# Altium schematic sheet reTerm-HW-M-IOLINK-SUPPLY.SchDoc: reTerm IOLINK SUPPLY
size 381 x 241 mm; DocumentNumber: 4; Revision: 1.0.0; SheetNumber: 4; SheetTotal: 4
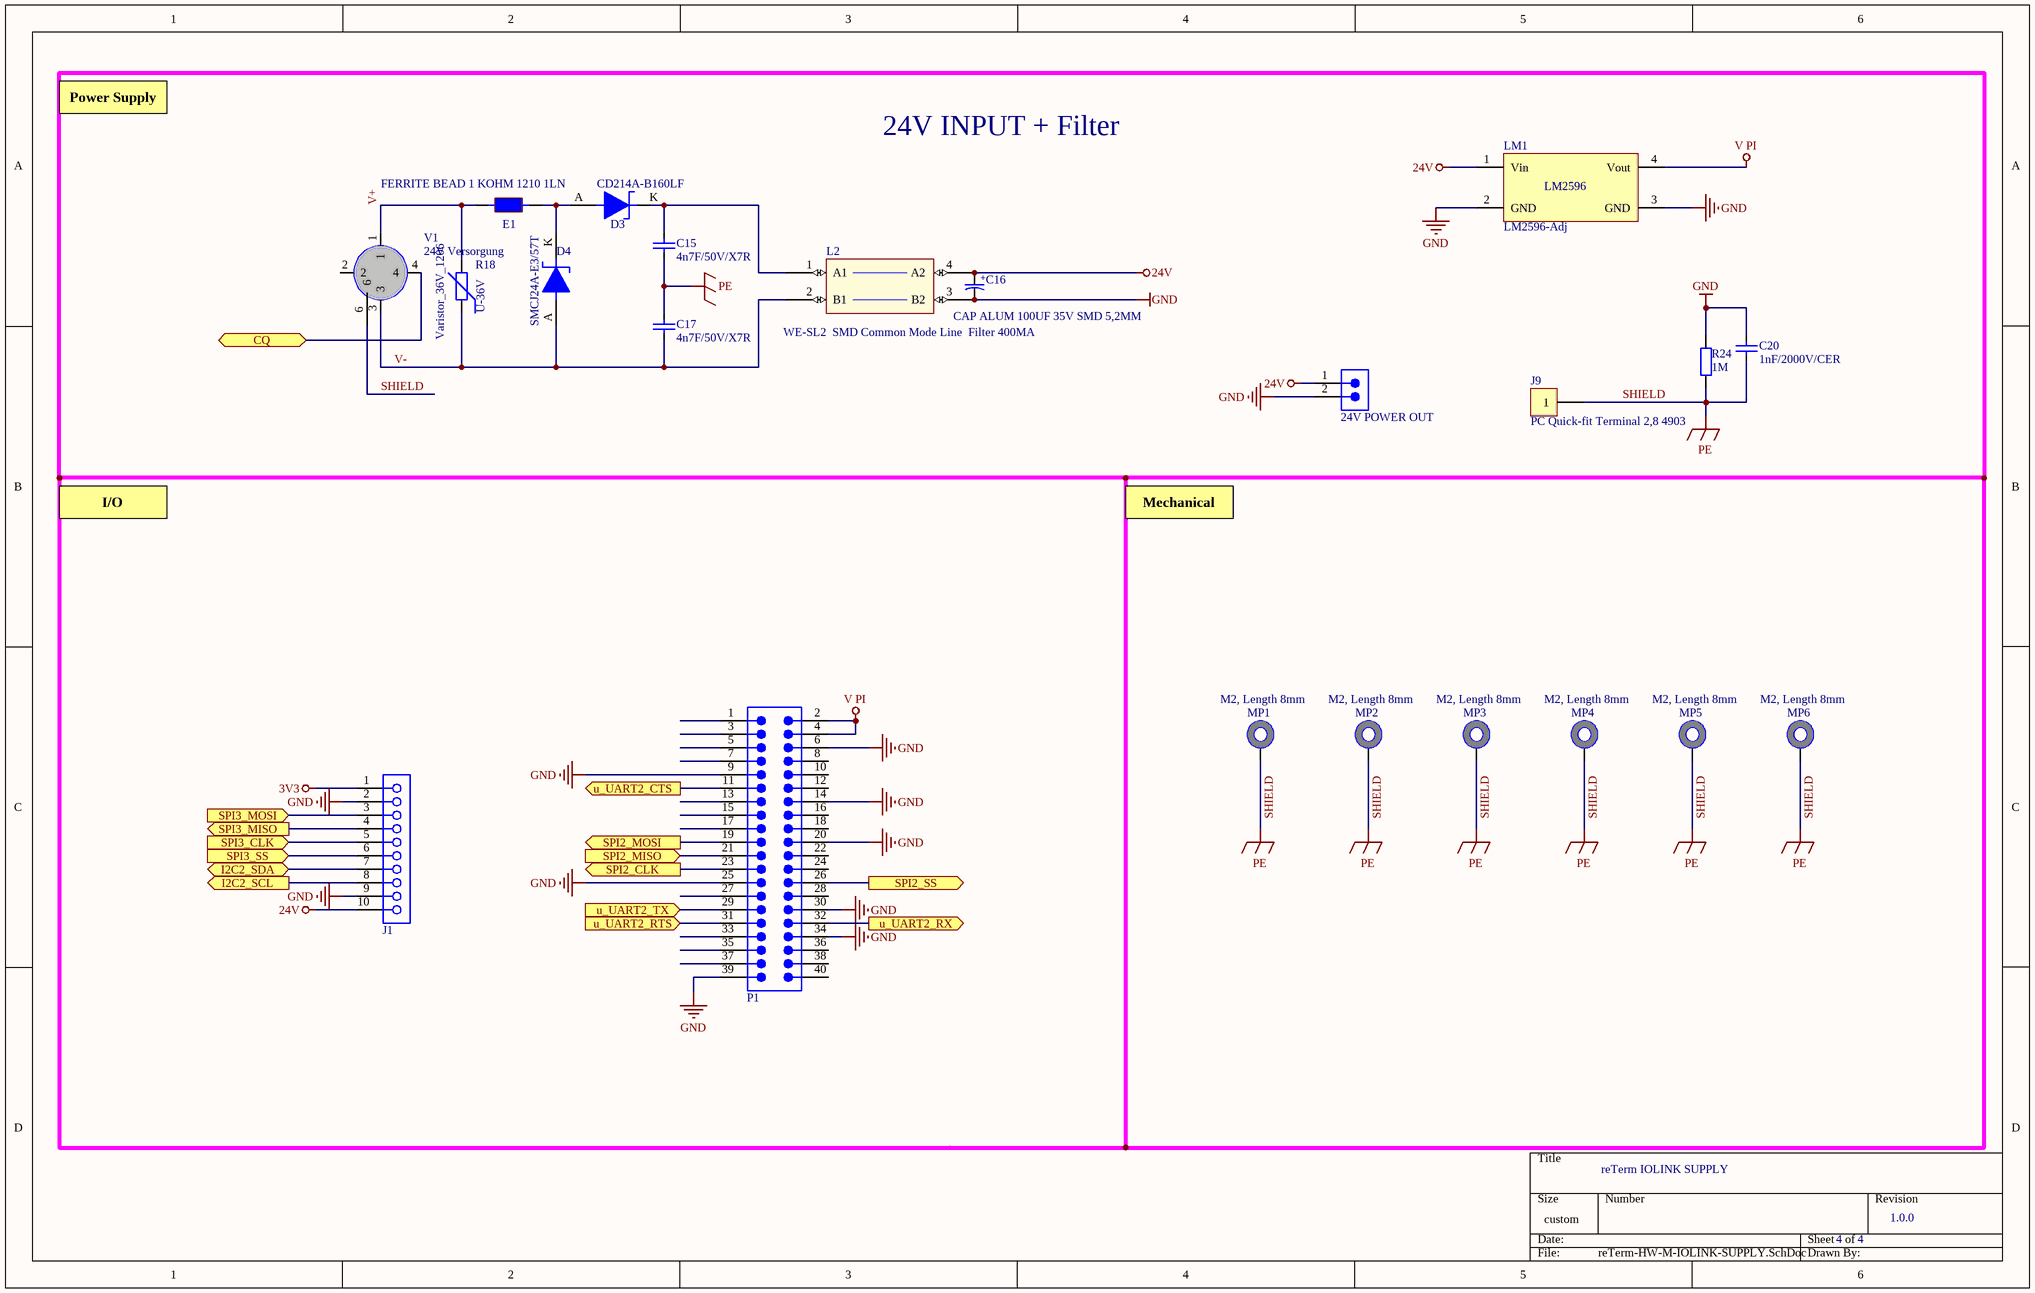
[diagram p0: reTerm-HW-M-IOLINK-SUPPLY.SchDoc]

## Parts
24V_POWER_OUT  691322310002  [WR Terminal, 3.81mm, 2p]  (value not drawn)
C15  4n7F/50V/X7R  [C0603]
C16  CAP ALUM 100UF 35V SMD 5,2MM  [SMD_ELKO_CASE_D8]
C17  4n7F/50V/X7R  [C0603]
C20  1nF/2000V/CER  [C1206]
D3  CD214A-B160LF  [DO-214AC]
D4  SMCJ24A-E3/57T  [DO-214AB]
E1  FERRITE BEAD 1 KOHM 1210 1LN  [L1210]
J1  62001011821  [Header, 2.00 mm, THT, 10p]  (value not drawn)
J9  PC Quick-fit Terminal 2,8 4903  [PC-Quick-FIT-TERMINAL-4903]
L2  WE-SL2  SMD Common Mode Line  Filter 400MA  [WE-SL2]
LM1  LM2596-Adj  [lm2596]
MP1  M2, Length 8mm  [9774080243]
MP2  M2, Length 8mm  [9774080243]
MP3  M2, Length 8mm  [9774080243]
MP4  M2, Length 8mm  [9774080243]
MP5  M2, Length 8mm  [9774080243]
MP6  M2, Length 8mm  [9774080243]
P1  61304021121  [WR-PHD Pin Header, THT, 2.54mm, 40P]  (value not drawn)
R18  Varistor_36V_1206  [V1206]
R24  1M  [R1206]
V1  24V Versorgung  [M12/4POL/A-COD/STECKER]

## Ports
CQ (bidir), I2C2_SCL (out), I2C2_SDA (bidir), SPI2_CLK (out), SPI2_MISO (in), SPI2_MOSI (out), SPI2_SS (out), SPI3_CLK (in), SPI3_MISO (out), SPI3_MOSI (in), SPI3_SS (in), u_UART2_CTS (out), u_UART2_RTS (in), u_UART2_RX (out), u_UART2_TX (in)

## Nets
3V3: J1.1
24V: 24V_POWER_OUT.1 C16.1 J1.10 L2.4(A2) LM1.1(Vin)
GND: 24V_POWER_OUT.2 C16.2 C20.2 J1.2 J1.9 L2.3(B2) LM1.2(GND) LM1.3(GND) P1.6 P1.9 P1.14 P1.20 P1.25 P1.30 P1.34 P1.39 R24.2
SHIELD: C15.1 C17.1 C20.1 J9.1 MP1.1 MP2.1 MP3.1 MP4.1 MP5.1 MP6.1 R24.1 V1.6  [also labelled PE]
V PI: LM1.4(Vout) P1.2 P1.4
CQ: V1.4 ; port CQ
I2C2_SCL: J1.8 ; port I2C2_SCL
I2C2_SDA: J1.7 ; port I2C2_SDA
SPI2_CLK: P1.23 ; port SPI2_CLK
SPI2_MISO: P1.21 ; port SPI2_MISO
SPI2_MOSI: P1.19 ; port SPI2_MOSI
SPI2_SS: P1.26 ; port SPI2_SS
SPI3_CLK: J1.5 ; port SPI3_CLK
SPI3_MISO: J1.4 ; port SPI3_MISO
SPI3_MOSI: J1.3 ; port SPI3_MOSI
SPI3_SS: J1.6 ; port SPI3_SS
u_UART2_CTS: P1.11 ; port u_UART2_CTS
u_UART2_RTS: P1.31 ; port u_UART2_RTS
u_UART2_RX: P1.32 ; port u_UART2_RX
u_UART2_TX: P1.29 ; port u_UART2_TX
V+: E1.1 R18.2 V1.1
V-: C17.2 D4.A L2.2(B1) R18.1 V1.3
NetC15_2: C15.2 D3.K L2.1(A1)
NetD3_A: D3.A D4.K E1.2

Not connected (* = marked no-connect by the designer): P1 1 3 5 7 8 10 12 13 15 16 17 18 22 24 27 28 33 35 36 37 38 40; V1 2

## Notes on the sheet
- Power Supply
- 24V INPUT + Filter
- I/O
- Mechanical
- (in symbol CAP ALUM 100UF 20% 35V SMD 5,2MM) +
- (in symbol LM2596-Adj) LM2596
- (in symbol Varistor_36V_1206) U-36V

## Library data of the parts
24V_POWER_OUT = WR Terminal, 3.81mm, 2p: WR-TBL Series 322 Horizontal PCB Header, THT, pitch 3.81mm, 2p; Manufacturer: Wurth Elektronik; Modularity: No; Rated Current: 10A; Working Voltage: 300V; ComponentLink1Description: Website Link; ComponentLink1URL: https://www.we-online.com/redexpert/article/691322310002?ad; ComponentLink2Description: Datasheet Link; ComponentLink2URL: https://www.we-online.com/redexpert/spec/691322310002?ad; Manufacturer Part Number: 691322310002; Category: Terminal Blocks; Match Code: WR-TBL; Mount: Through Hole; Operating Temperature Max: 105°C; Operating Temperature Min: -40°C; Packaging: Box; Application: Pluggable; Number of Pins: 2; Number of Rows: 1; Orientation: Horizontal; Pitch: 3.81mm
C15 C17 = CAP_4n7F_50V_X7R: 4n7F/50V/X7R 0603; Supplier 1: Digi-Key; Supplier 2: Farnell; Supplier Part Number 1: 399-6896-1-ND; Supplier Part Number 2: 2070427
C16 = CAP ALUM 100UF 20% 35V SMD 5,2MM: Supplier 1: Digi-Key; Supplier 2: Mouser; Supplier Part Number 1: 565-2475-1-ND; Supplier Part Number 2: 661-EMVY350ADA470MF5
C20 = CAP_1nF_2000V_CER_1: 1nF/2000V/CER 1206; Supplier 1: Digi-Key; Supplier Part Number 1: 1276-3074-1-ND
D3 = CD214A-B160LF: DIODE SCHOTTKY 60V 1A SMA; Supplier 1: Farnell; Supplier 2: Digi-Key; Supplier Part Number 1: 1456528; Supplier Part Number 2: CD214A-B160LFDKR-ND; Supplier 3: Digi-Key; Supplier Part Number 3: CD214A-B160LFCT-ND
D4 = SMCJ24A-E3/57T: TVS DIODE 24VWM 38.9VC SMC; Supplier 1: Farnell; Supplier Part Number 1: 1837070; Supplier 2: Digi-Key; Supplier Part Number 2: SMCJ24A-E3/57TGICT-ND
E1 = FERRITE BEAD 1 KOHM 1210 1LN: 1 kOhms @ 100MHz 1 Stromleitung Ferritperlen und -chips 1210 (3225 metrisch) 2A 100mOhm   Taiyo Yuden FBMH3225HM102NT; Supplier 1: Digi-Key; Supplier 2: Mouser; Supplier Part Number 1: 587-1753-1-ND; Supplier Part Number 2: 963-FBMH3225HM102NT
J1 = WR-PHD Header, THT, 2mm, 10P: WR-PHD Socket Header, THT, Vertical, pitch 2mm, 1 Row, 10P; Manufacturer: Wurth Elektronik; Contact Resistance: 20mOhm; Rated Current: 2A; Working Voltage: 250V; Withstanding Voltage: 500V; Manufacturer Part Number: 62001011821; Category: Board-to-Board Connectors; Match Code: WR-PHD; ComponentLink1Description: Website Link; ComponentLink1URL: https://www.we-online.com/redexpert/article/62001011821?ad; ComponentLink2Description: Datasheet Link; ComponentLink2URL: https://www.we-online.com/redexpert/spec/62001011821?ad; Mount: Through Hole; Operating Temperature Max: 105°C; Operating Temperature Min: -40°C; Packaging: Tube; Gender: Socket Header; Number of Pins: 10; Number of Rows: 1; Orientation: Vertical; Pitch: 2mm
J9 = PC Quick-fit Terminal 2,8 4903: PC Quick-Fit Terminal 2,8 / Keystone 4903; Supplier 1: Digi-Key; Supplier 2: Mouser; Supplier Part Number 1: 36-4903-ND; Supplier Part Number 2: 534-4903
L2 = WE-SL2 COMMON-CHOKE 400MA: EMI Signal Line Filter WE-SL2 744229; Supplier 1: Digi-Key; Supplier 2: Distrelec; Supplier Part Number 1: 732-1488-1-ND; Supplier Part Number 2: 744229
LM1 = LM2596-Adj: Designed By @Alixahedi
MP1-MP6 = 9774080243R: WA-SMSI SMT Steel Spacer, M2 Thread Internal, Length 8mm; InnerDiameter: 2.8mm; OuterDiameter: 4.35mm; PublishedDate: Dec. 2016; Publisher: Wurth Elektronik; ComponentLink1Description: Manufacturer; ComponentLink1URL: http://www.we-online.de; ComponentLink2Description: Datasheet; ComponentLink2URL: http://katalog.we-online.de/em/datasheet/9774080243R.pdf; PartNumber: 9774080243R; Length: 8mm; Thread: M2; Packaging: Tape and Reel
P1 = WR-PHD Pin Header, 2.54mm, 40P: WR-PHD Pin Header, THT, Vertical, pitch 2.54mm, 2 Row, 40P; Manufacturer: Wurth Elektronik; Contact Resistance: 20mOhm; Rated Current: 3A; Working Voltage: 250V; Withstanding Voltage: 500V; Manufacturer Part Number: 61304021121; Category: Board-to-Board Connectors; Match Code: WR-PHD; ComponentLink1Description: Website Link; ComponentLink1URL: https://www.we-online.com/redexpert/article/61304021121?ad; ComponentLink2Description: Datasheet Link; ComponentLink2URL: https://www.we-online.com/redexpert/spec/61304021121?ad; Mount: Through Hole; Operating Temperature Max: 105°C; Operating Temperature Min: -40°C; Packaging: Bag; Gender: Pin Header; Number of Pins: 40; Number of Rows: 2; Orientation: Vertical; Pitch: 2.54mm
R18 = Varistor_36V_1206: Varistor_36V_1206_82541300; Supplier 1: Würth Elektronik; Supplier Part Number 1: 82541300
R24 = R1M: Resistor-1M
V1 = M12 Flanschdose 4 Serie 713/763: M12 Flanschdose 4-polig Serie 713/763; Manufacturer 1: Franz Binder GmbH & Co.; Manufacturer Part Number 1: 99 3432 601 04; Supplier 1: R.E.D. GmbH; Supplier Part Number 1: 99 3432 601 04